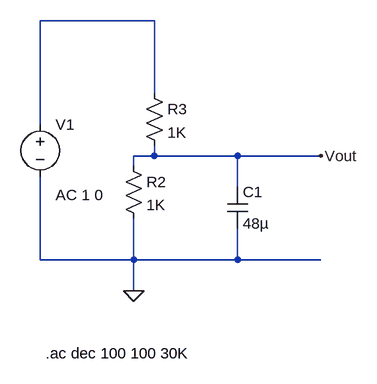
[diagram p0: schematic FreqResponse.asc]
FreqResponse.asc, the LTspice schematic file:
Version 4
SHEET 1 880 680
WIRE 160 -16 -16 -16
WIRE 160 96 160 -16
WIRE -16 144 -16 -16
WIRE 160 192 160 176
WIRE 160 192 128 192
WIRE 288 192 160 192
WIRE 416 192 288 192
WIRE 128 208 128 192
WIRE 288 240 288 192
WIRE -16 352 -16 224
WIRE 128 352 128 288
WIRE 128 352 -16 352
WIRE 288 352 288 304
WIRE 288 352 128 352
WIRE 416 352 288 352
WIRE 128 400 128 352
FLAG 128 400 0
FLAG 416 192 Vout
SYMBOL res 112 192 R0
SYMATTR InstName R2
SYMATTR Value 1K
SYMBOL res 144 80 R0
SYMATTR InstName R3
SYMATTR Value 1K
SYMBOL voltage -16 128 R0
WINDOW 123 24 124 Left 2
WINDOW 39 0 0 Left 0
SYMATTR Value2 AC 1 0
SYMATTR InstName V1
SYMATTR Value ""
SYMBOL cap 272 240 R0
SYMATTR InstName C1
SYMATTR Value 48µ
TEXT -8 496 Left 2 !.ac dec 100 100 30K

The netlist it stands for:
* FreqResponse.asc
R2 Vout 0 1K
R3 N001 Vout 1K
V1 N001 0 AC 1 0
C1 Vout 0 48µ
.ac dec 100 100 30K
.backanno
.end

* Results of the author's LTspice run, read from the files saved beside the schematic
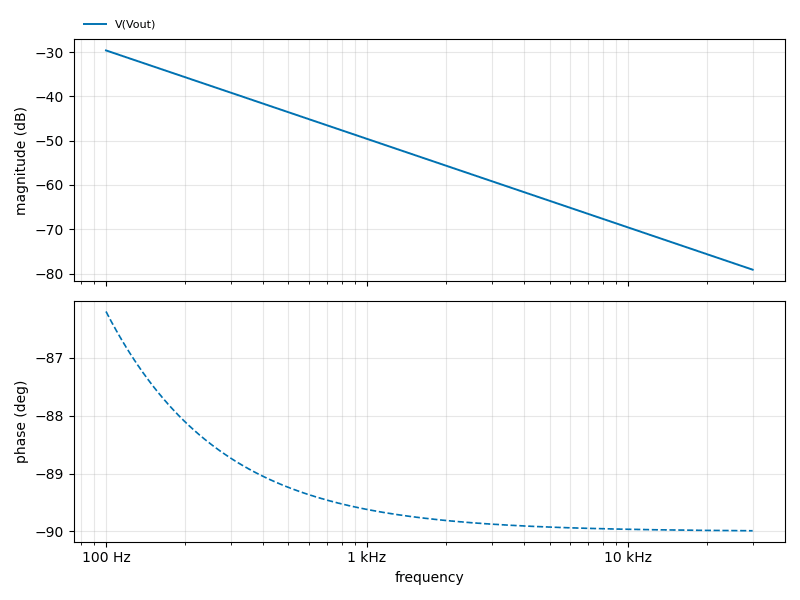
[diagram p1: AC Analysis of FreqResponse.asc, plotted from the saved traces]
* AC Analysis, 1 run:
*   V(Vout): -29.61 dB at 100 Hz, -79.13 dB at 30 kHz, peak -29.61 dB at 100 Hz, 3 dB below the peak at 141.6 Hz